# EAGLE design ball_catch_sensor_2 (EAGLE 9.6.2)
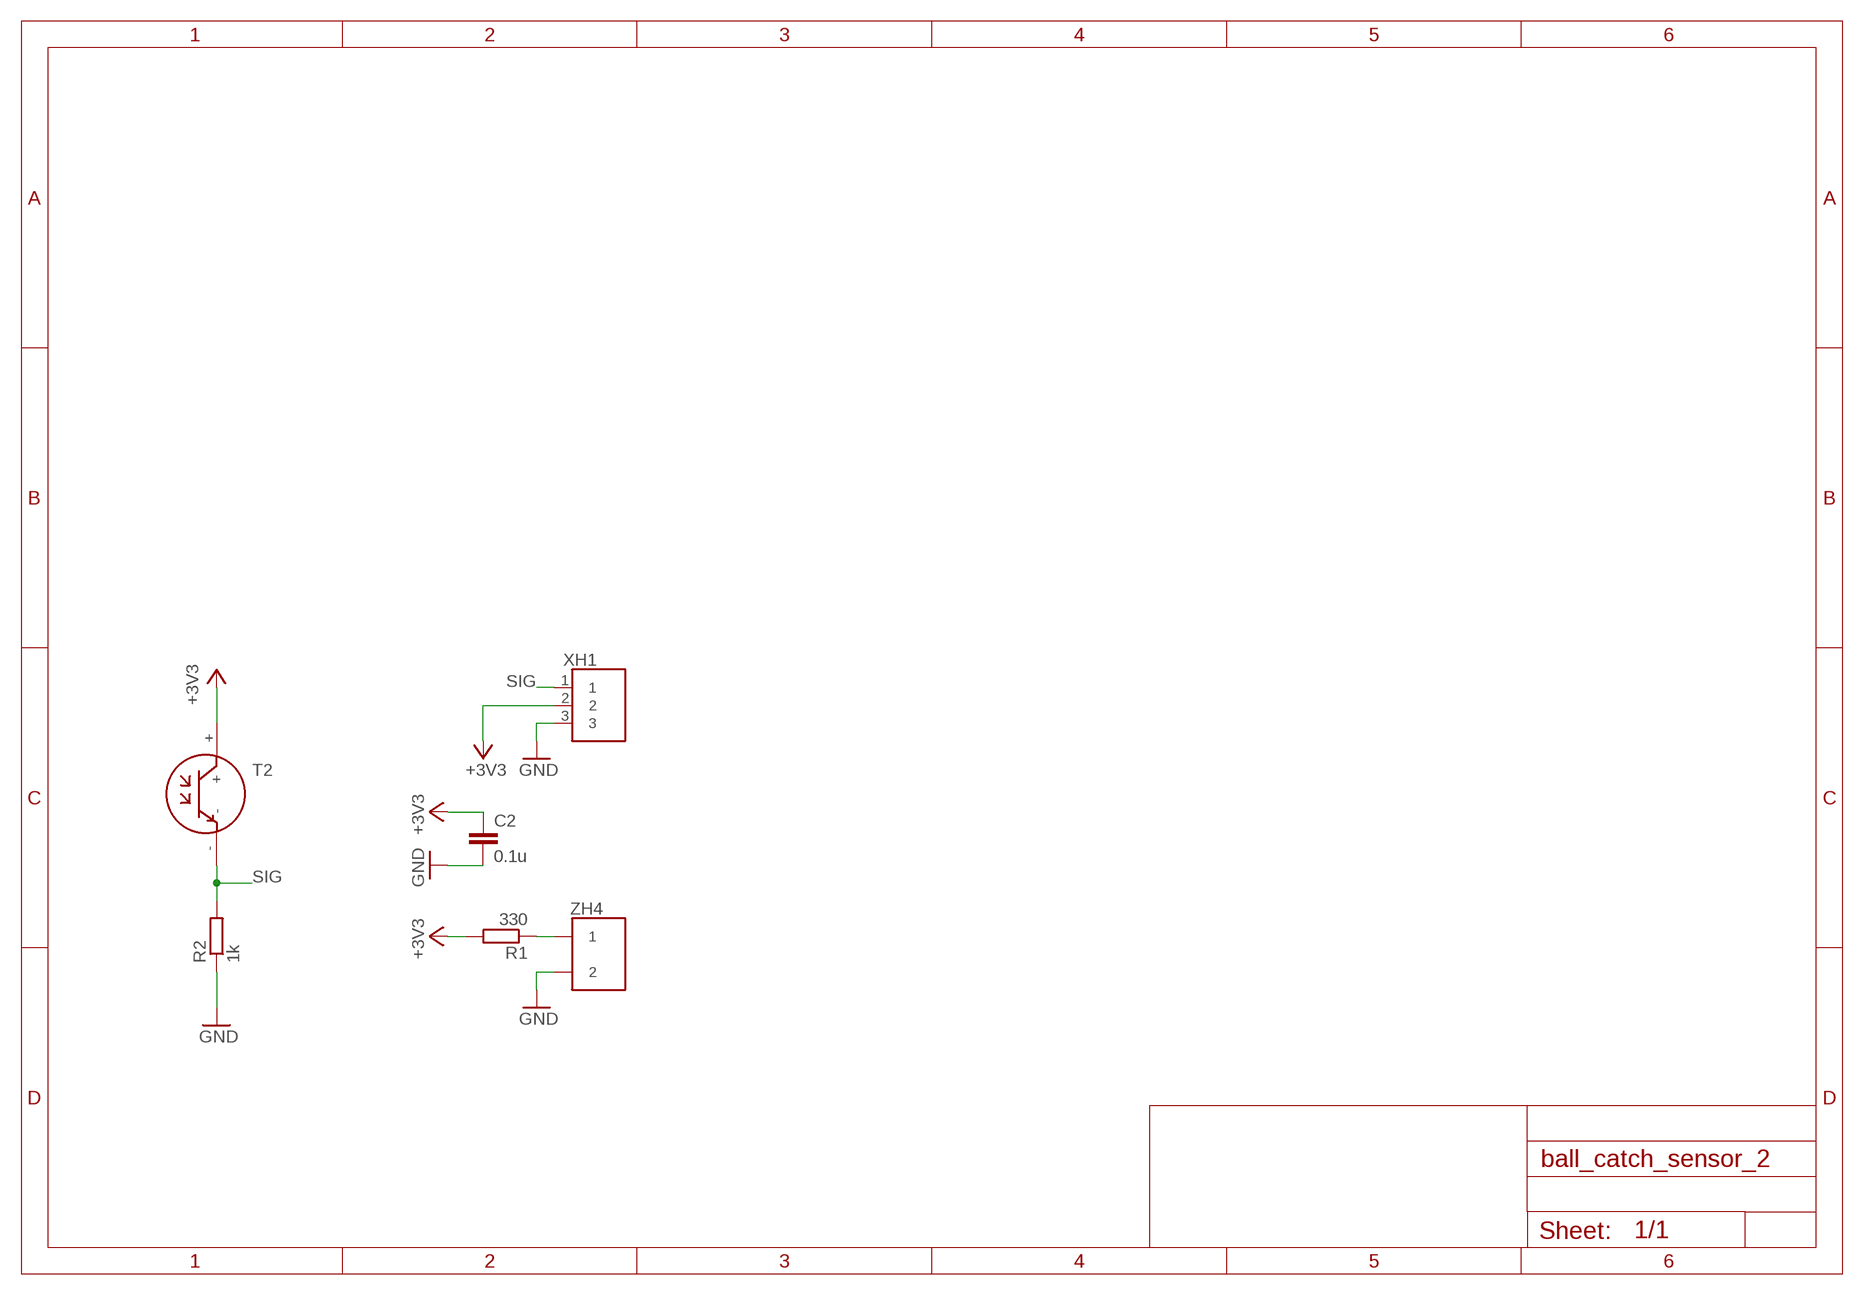
[diagram p0: schematic, sheet 1]

## Parts
C2  0.1u  C-EUC0603  [C0603]
R1  330  R-EU_0207/10  [0207/10]
R2  1k  R-EU_0207/10  [0207/10]
T2  NJL7302L-F3  [NJL7302L-F3]
XH1  S3B  [S3B]
ZH4  2B  [2B]

## Nets
+3V3: C2.1 R1.2 T2.+ XH1.2
GND: C2.2 R2.1 XH1.3 ZH4.2
N$2: R1.1 ZH4.1
SIG: R2.2 T2.- XH1.1

## Library data of the parts
C2 = rcl:C-EU: CAPACITOR, European symbol; SPICEPREFIX: C
R1 R2 = rcl:R-EU_: RESISTOR, European symbol; SPICEPREFIX: R
T2 = NJL7302L-F3:NJL7302L-F3
XH1 = XH:S3B
ZH4 = ZH:2B

## Board
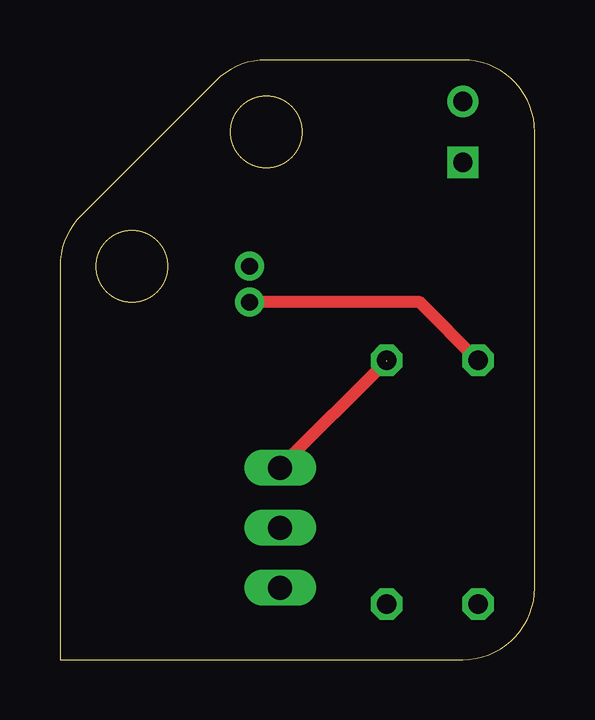
[diagram p1: board, top side]
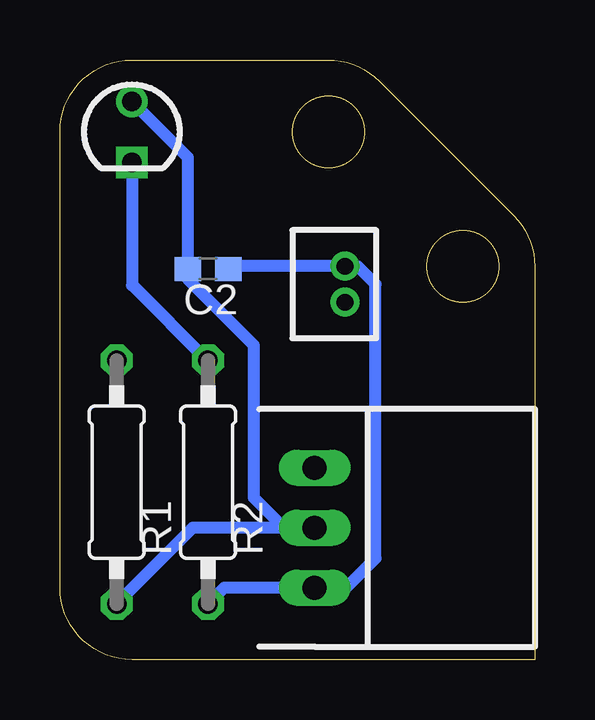
[diagram p2: board, bottom side, seen from below]

Size 19.8 x 25 mm. Coordinates in mm from the lower left corner, seen from the top.
Outline: 16.8,0 arc90 19.8,3 19.8,22 arc90 16.8,25 8.61,25 arc45 6.49,24.12 0.88,18.51 arc45 0,16.39 0,0 16.8,0
Outline: circle at 3,16.39 radius 1.5
Outline: circle at 8.61,22 radius 1.5
Copper layers (1*16): Top 0.035mm / dielectric 1.5mm / Bottom 0.035mm
Design rules "default": minimum track width 6mil, minimum drill 0.35mm, track to track 6mil, track to pad 6mil, pad to pad 6mil, via to via 6mil, smd to smd 6mil, copper to edge 40mil, drill to drill 6mil, minimum pad ring 10mil, minimum via ring 8mil, stop-mask expansion 4mil, vias tented up to drill 0mil, thermal gap 10mil

### Footprints (pad centres in the part's own frame; a part is rotated, then mirrored left to right if it is on the bottom)
C0603 = smd 1.1 x 1: 1 -0.85,0; 2 0.85,0
0207/10 = drill 0.813 octagon: 1 -5.08,0; 2 5.08,0
NJL7302L-F3 = drill 0.8: + 1.27,0 | drill 0.8 square: - -1.27,0
S3B = drill 1 long: 1 0,2.5; 2 0,0; 3 0,-2.5
2B = drill 0.7: 1 0,0.75; 2 0,-0.75

### Placement (x,y rotation side)
C2  13.63,16.29 0 bottom
R1  17.44,7.39 270 bottom
R2  13.63,7.39 90 bottom
T2  16.8,22 90 bottom
XH1  9.18,5.49 0 bottom
ZH4  7.91,15.65 180 bottom

### Tracks (layer width: path | path; a pad name or v marks a point on that pad's centre or on a via)
+3V3
  Bottom 0.5: XH1.2 10.45,5.49 | 10.45,5.49 14.26,5.49 R1.2 | T2.+ 14.48,20.95 C2.1 14.48,15.87 11.72,13.11 11.72,6.76 10.45,5.49
GND
  Bottom 0.5: C2.2 12.66,16.4 ZH4.2 7.39,16.4 6.64,15.65 6.64,4.22 7.87,2.99 XH1.3 12.95,2.99 R2.1
N$2
  Top 0.5: ZH4.1 15.01,14.9 R1.1
SIG  (1 unrouted)
  Top 0.5: XH1.1 9.18,8.03 R2.2
  Bottom 0.5: T2.- 16.8,15.61 13.63,12.44